# Altium schematic sheet Esp32_Wroom(Contrôle d'entrée.SchDoc
size Tabloid; SheetNumber: 7; SheetTotal: 7
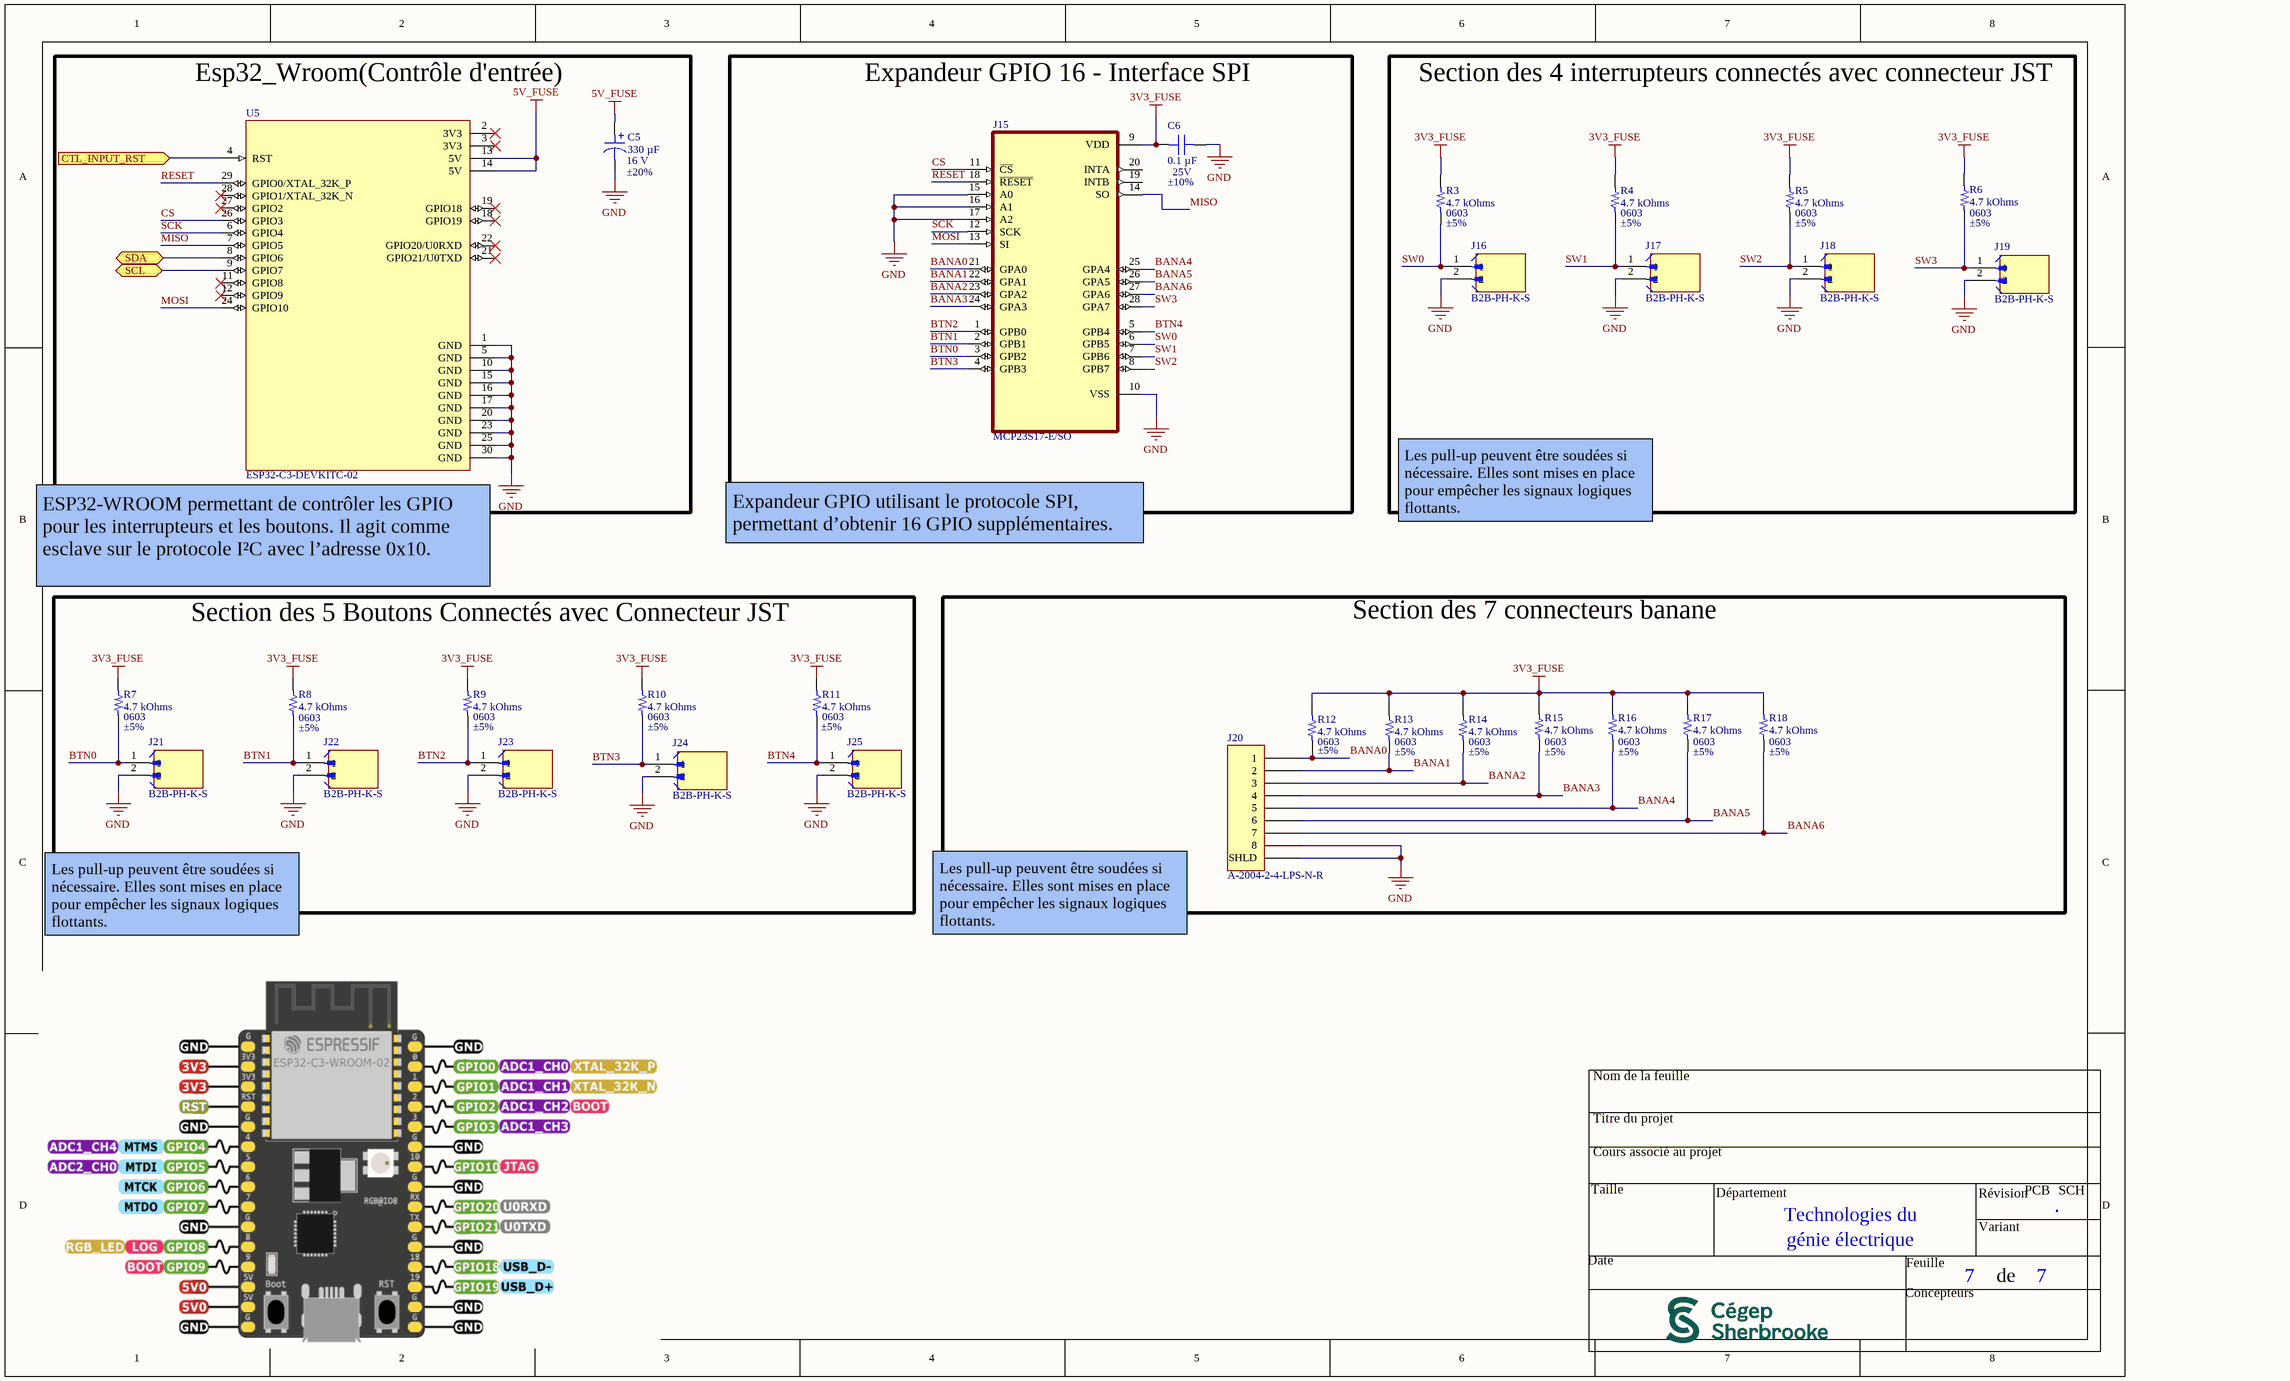
[diagram p0: Esp32_Wroom(Contrôle d'entrée.SchDoc]

## Parts
C5  330 µF  Tolerance: ±20%  Voltage - Rated: 16 V  [CAP ALSMD 8.3MM H10.5MM]
C6  Tolerance: ±10%  Voltage - Rated: 25V  [CAP 0805_2012]  (hidden comment: 0.1 µF)
J15  MCP23S17-E/SO  [SOIC127P1030X265-28N]
J16  B2B-PH-K-S  [JST_B2B-PH-K-S]
J17  B2B-PH-K-S  [JST_B2B-PH-K-S]
J18  B2B-PH-K-S  [JST_B2B-PH-K-S]
J19  B2B-PH-K-S  [JST_B2B-PH-K-S]
J20  A-2004-2-4-LPS-N-R  [ASSMANN A-2004-2-4-LPS-N-R]
J21  B2B-PH-K-S  [JST_B2B-PH-K-S]
J22  B2B-PH-K-S  [JST_B2B-PH-K-S]
J23  B2B-PH-K-S  [JST_B2B-PH-K-S]
J24  B2B-PH-K-S  [JST_B2B-PH-K-S]
J25  B2B-PH-K-S  [JST_B2B-PH-K-S]
R3  Supplier Device Package: 0603  Tolerance: ±5%  [RES 0603_1608]  (hidden comment: 4.7 kOhms)
R4  Supplier Device Package: 0603  Tolerance: ±5%  [RES 0603_1608]  (hidden comment: 4.7 kOhms)
R5  Supplier Device Package: 0603  Tolerance: ±5%  [RES 0603_1608]  (hidden comment: 4.7 kOhms)
R6  Supplier Device Package: 0603  Tolerance: ±5%  [RES 0603_1608]  (hidden comment: 4.7 kOhms)
R7  Supplier Device Package: 0603  Tolerance: ±5%  [RES 0603_1608]  (hidden comment: 4.7 kOhms)
R8  Supplier Device Package: 0603  Tolerance: ±5%  [RES 0603_1608]  (hidden comment: 4.7 kOhms)
R9  Supplier Device Package: 0603  Tolerance: ±5%  [RES 0603_1608]  (hidden comment: 4.7 kOhms)
R10  Supplier Device Package: 0603  Tolerance: ±5%  [RES 0603_1608]  (hidden comment: 4.7 kOhms)
R11  Supplier Device Package: 0603  Tolerance: ±5%  [RES 0603_1608]  (hidden comment: 4.7 kOhms)
R12  Supplier Device Package: 0603  Tolerance: ±5%  [RES 0603_1608]  (hidden comment: 4.7 kOhms)
R13  Supplier Device Package: 0603  Tolerance: ±5%  [RES 0603_1608]  (hidden comment: 4.7 kOhms)
R14  Supplier Device Package: 0603  Tolerance: ±5%  [RES 0603_1608]  (hidden comment: 4.7 kOhms)
R15  Supplier Device Package: 0603  Tolerance: ±5%  [RES 0603_1608]  (hidden comment: 4.7 kOhms)
R16  Supplier Device Package: 0603  Tolerance: ±5%  [RES 0603_1608]  (hidden comment: 4.7 kOhms)
R17  Supplier Device Package: 0603  Tolerance: ±5%  [RES 0603_1608]  (hidden comment: 4.7 kOhms)
R18  Supplier Device Package: 0603  Tolerance: ±5%  [RES 0603_1608]  (hidden comment: 4.7 kOhms)
U5  ESP32-C3-DEVKITC-02  [XCVR_ESP32-C3-DEVKITC-02]

## Blocks framed on the sheet
Esp32_Wroom(Contrôle d'entrée): C5 U5
Expandeur GPIO 16 - Interface SPI: C6 J15
Section des 4 interrupteurs connectés avec connecteur JST: J16-J19 R3-R6
Section des 5 Boutons Connectés avec Connecteur JST: J21-J25 R7-R11
Section des 7 connecteurs banane: J20 R12-R18

## Ports
CTL_INPUT_RST (in), SCL (bidir), SDA (bidir)

## Nets
3V3_FUSE: C6.1 J15.9(VDD) R3.2 R4.2 R5.2 R6.2 R7.2 R8.2 R9.2 R10.2 R11.2 R12.2 R13.2 R14.2 R15.2 R16.2 R17.2 R18.2
5V_FUSE: C5.1 U5.13(5V) U5.14(5V)
GND: C5.2 C6.2 J15.10(VSS) J15.15(A0) J15.16(A1) J15.17(A2) J16.2 J17.2 J18.2 J19.2 J20.8 J20.S(SHLD) J21.2 J22.2 J23.2 J24.2 J25.2 U5.1(GND) U5.5(GND) U5.10(GND) U5.15(GND) U5.16(GND) U5.17(GND) U5.20(GND) U5.23(GND) U5.25(GND) U5.30(GND)
BANA0: J15.21(GPA0) J20.1 R12.1
BANA1: J15.22(GPA1) J20.2 R13.1
BANA2: J15.23(GPA2) J20.3 R14.1
BANA3: J15.24(GPA3) J20.4 R15.1
BANA4: J15.25(GPA4) J20.5 R16.1
BANA5: J15.26(GPA5) J20.6 R17.1
BANA6: J15.27(GPA6) J20.7 R18.1
BTN0: J15.3(GPB2) J21.1 R7.1
BTN1: J15.2(GPB1) J22.1 R8.1
BTN2: J15.1(GPB0) J23.1 R9.1
BTN3: J15.4(GPB3) J24.1 R10.1
BTN4: J15.5(GPB4) J25.1 R11.1
CS: J15.11(~{CS}) U5.26(GPIO3)
CTL_INPUT_RST: U5.4(RST) ; port CTL_INPUT_RST
MISO: J15.14(SO) U5.7(GPIO5)
MOSI: J15.13(SI) U5.24(GPIO10)
RESET: J15.18(~{RESET}) U5.29(GPIO0/XTAL_32K_P)
SCK: J15.12(SCK) U5.6(GPIO4)
SCL: U5.9(GPIO7) ; port SCL
SDA: U5.8(GPIO6) ; port SDA
SW0: J15.6(GPB5) J16.1 R3.1
SW1: J15.7(GPB6) J17.1 R4.1
SW2: J15.8(GPB7) J18.1 R5.1
SW3: J15.28(GPA7) J19.1 R6.1

Not connected (* = marked no-connect by the designer): J15 19(INTB) 20(INTA); U5 2(3V3)* 3(3V3)* 11(GPIO8)* 12(GPIO9)* 18(GPIO19)* 19(GPIO18)* 21(GPIO21/U0TXD)* 22(GPIO20/U0RXD)* 27(GPIO2)* 28(GPIO1/XTAL_32K_N)*

## Notes on the sheet
- Les pull-up peuvent être soudées si nécessaire. Elles sont mises en place pour empêcher les signaux logiques flottants.
- (near U5) ESP32-WROOM permettant de contrôler les GPIO pour les interrupteurs et les boutons. Il agit comme esclave sur le protocole I²C avec l’adresse 0x10.
- Expandeur GPIO utilisant le protocole SPI, permettant d’obtenir 16 GPIO supplémentaires.
- Nom de la feuille
- Titre du projet
- Cours associé au projet
- Taille
- Département
- Technologies du
- Révision
- PCB
- .
- SCH
- Date
- génie électrique
- Feuille
- Variant
- de
- Concepteurs

## Library data of the parts
C5 = 865060353008: CAP ALUM 330UF 20% 16V SMD; manufacturer: Würth Elektronik; Impedance: 170 mOhms; Lifetime @ Temp.: 5000 Hrs @ 105°C; Polarization: Polar; Ripple Current @ High Frequency: 550 mA @ 100 kHz; Ripple Current @ Low Frequency: 357.5 mA @ 120 Hz; Surface Mount Land Size: 0.327" L x 0.327" W (8.30mm x 8.30mm); Part Number: 865060353008; Applications: General Purpose; Capacitance: 330 µF; componentlink1description: Datasheet; componentlink1url: https://katalog.we-online.de/pbs/datasheet/865060353008.pdf; componentlink2description: DigiKey Link; componentlink2url: https://www.digikey.com/en/products/detail/würth-elektronik/865060353008/5728120; Device Package: Radial, Can - SMD; Height - Seated (Max): 0.413" (10.50mm); lastupdated: 2024-06-03 8:15:49 PM; Lifecycle Status: Active; Minimum Order: 1; Mounting Type: Surface Mount; Operating Temperature: -55°C ~ 105°C; Package / Case: Radial, Can - SMD; packaging: TapeAndReel; partid: 7463; Part Status: Active; price: 0.39; series: WCAP-ASLL; Size / Dimension: 0.315" Dia (8.00mm); Supplier 1: DigiKey; Supplier Part Number 1: 732-8525-1-ND; value: 330 µF
C6 = 0805Y0250104KXT: CAP CER 0.1UF 25V X7R 0805; manufacturer: Knowles Syfer; Part Number: 0805Y0250104KXT; Capacitance: 0.1 µF; Applications: Boardflex Sensitive; componentlink1description: Datasheet; componentlink1url: https://www.knowlescapacitors.com/getattachment/2dbfc8bc-e2b3-4b4d-afb1-43b011b9ebe0/High-Std-Voltage.aspx; componentlink2description: DigiKey Link; componentlink2url: https://www.digikey.com/en/products/detail/knowles-syfer/0805Y0250104KXT/5729991; Device Package: 0805 (2012 Metric); Features: Soft Termination; lastupdated: 2024-02-09 8:16:06 PM; Lifecycle Status: Active; Minimum Order: 1; Mounting Type: Surface Mount, MLCC; Operating Temperature: -55°C ~ 125°C; Package / Case: 0805 (2012 Metric); packaging: TapeAndReel; partid: 3471; Part Status: Active; price: 0.15; series: FlexiCap™; Size / Dimension: 0.079" L x 0.049" W (2.00mm x 1.25mm); Supplier 1: DigiKey; Supplier Part Number 1: 1608-1010-1-ND; Temperature Coefficient: X7R; Thickness (Max): 0.051" (1.30mm); value: 0.1 µF
J15 = MCP23S17-E/SO: Microchip MCP23S17-E/SO,16-channel 16bit I/O Exp&er 5MHz,Serial-SPI,28-Pin SOIC | Microchip Technology Inc. MCP23S17-E/SO; SnapEDA_Link: https://www.snapeda.com/parts/MCP23S17-E/SO/Microchip/view-part/?ref=snap; Package: SOIC-28 Microchip; Value: *; MF: Microchip; MP: MCP23S17-E/SO; Check_prices: https://www.snapeda.com/parts/MCP23S17-E/SO/Microchip/view-part/?ref=eda
J16-J19 J21-J25 = B2B-PH-K-S: Connector Header Through Hole 2 position 0.079 (2.00mm); MF: JST Sales America Inc.; SnapEDA_Link: https://www.snapeda.com/parts/B2B-PH-K-S/JST/view-part/?ref=snap; Package: None; Value: *; MP: B2B-PH-K-S; Check_prices: https://www.snapeda.com/parts/B2B-PH-K-S/JST/view-part/?ref=eda
J20 = A-2004-2-4-LPS-N-R: CONN MOD JACK 8P8C R/A SHIELDED; Manufacturer: Assmann WSW Components; LED Color: Does Not Contain LED; Number of Ports: 1; Number of Positions/Contacts: 8p8c (RJ45, Ethernet); Tab Direction: Down; Part Number: A-2004-2-4-LPS-N-R; ComponentLink1Description: Datasheet; ComponentLink1URL: http://www.assmann-wsw.com/fileadmin/datasheets/ASS_7323_CO.pdf; ComponentLink2Description: DigiKey Link; ComponentLink2URL: http://digikey.com/product-detail/en/assmann-wsw-components/A-2004-2-4-LPS-N-R/AE10387-ND/2183638; Connector Type: Jack; Contact Finish: Gold; Contact Material: Phosphor Bronze; Features: Board Lock; LastUpdated: 2020-01-15 3:54:20 AM; Lifecycle Status: Active; Minimum Order: 1; Mounting Type: Through Hole; Number of Rows: 1; Orientation: 90° Angle (Right); Packaging: Tray; Part Status: Active; Price: 1.05; Series: -; Shielding: Shielded; Supplier 1: DigiKey; Supplier Part Number 1: AE10387-ND; Termination: Solder
R3-R18 = ESR03EZPJ472: RES SMD 4.7K OHM 5% 1/4W 0603; Manufacturer: Rohm Semiconductor; Power (Watts): 0.25W, 1/4W; Temperature Coefficient: ±200ppm/°C; Part Number: ESR03EZPJ472; Value: 4.7 kOhms; ComponentLink1Description: Datasheet; ComponentLink1URL: https://www.rohm.com/datasheet/ESR01MZPF/esr-e; ComponentLink2Description: DigiKey Link; ComponentLink2URL: https://www.digikey.com/en/products/detail/rohm-semiconductor/ESR03EZPJ472/1762733; Composition: Thick Film; Device Package: 0603 (1608 Metric); Features: Automotive AEC-Q200, Pulse Withstanding; Height - Seated (Max): 0.022" (0.55mm); LastUpdated: 2024-02-09 8:43:15 PM; Lifecycle Status: Active; Minimum Order: 1; Number of Terminations: 2; Operating Temperature: -55°C ~ 155°C; Package / Case: 0603 (1608 Metric); Packaging: TapeAndReel; PartId: 10235; Part Status: Active; Price: 0.01; Ratings: AEC-Q200; Resistance: 4.7 kOhms; Series: ESR; Size / Dimension: 0.063" L x 0.031" W (1.60mm x 0.80mm); Supplier 1: DigiKey; Supplier Part Number 1: RHM4.7KDCT-ND
U5 = ESP32-C3-DEVKITC-02: The ESP32-C3-DEVKITC-02 Evaluation Board from Espressif Systems is a development platform for wireless applications, offering 802.11 b/g/n Wi-Fi and Bluetooth (BLE) connectivity at 2.4GHz. Powered by the ESP32-C3-WROOM-02 module, it features a 32-bit RISC; SnapEDA_Link: https://www.snapeda.com/parts/ESP32-C3-DevKitC-02/Espressif+Systems/view-part/?ref=snap; Package: None; Value: *; MF: Espressif Systems; MP: ESP32-C3-DevKitC-02; Check_prices: https://www.snapeda.com/parts/ESP32-C3-DevKitC-02/Espressif+Systems/view-part/?ref=eda